# EasyEDA schematic SCH_orbital_shaker_motherboard_v2_2022-09-11.json
TITLE: Sheet_1; REV: 1.0; Date: 2022-09-11; Sheet: 1/1; Drawn By: danielgigliotti99.dg; Company: Your Company
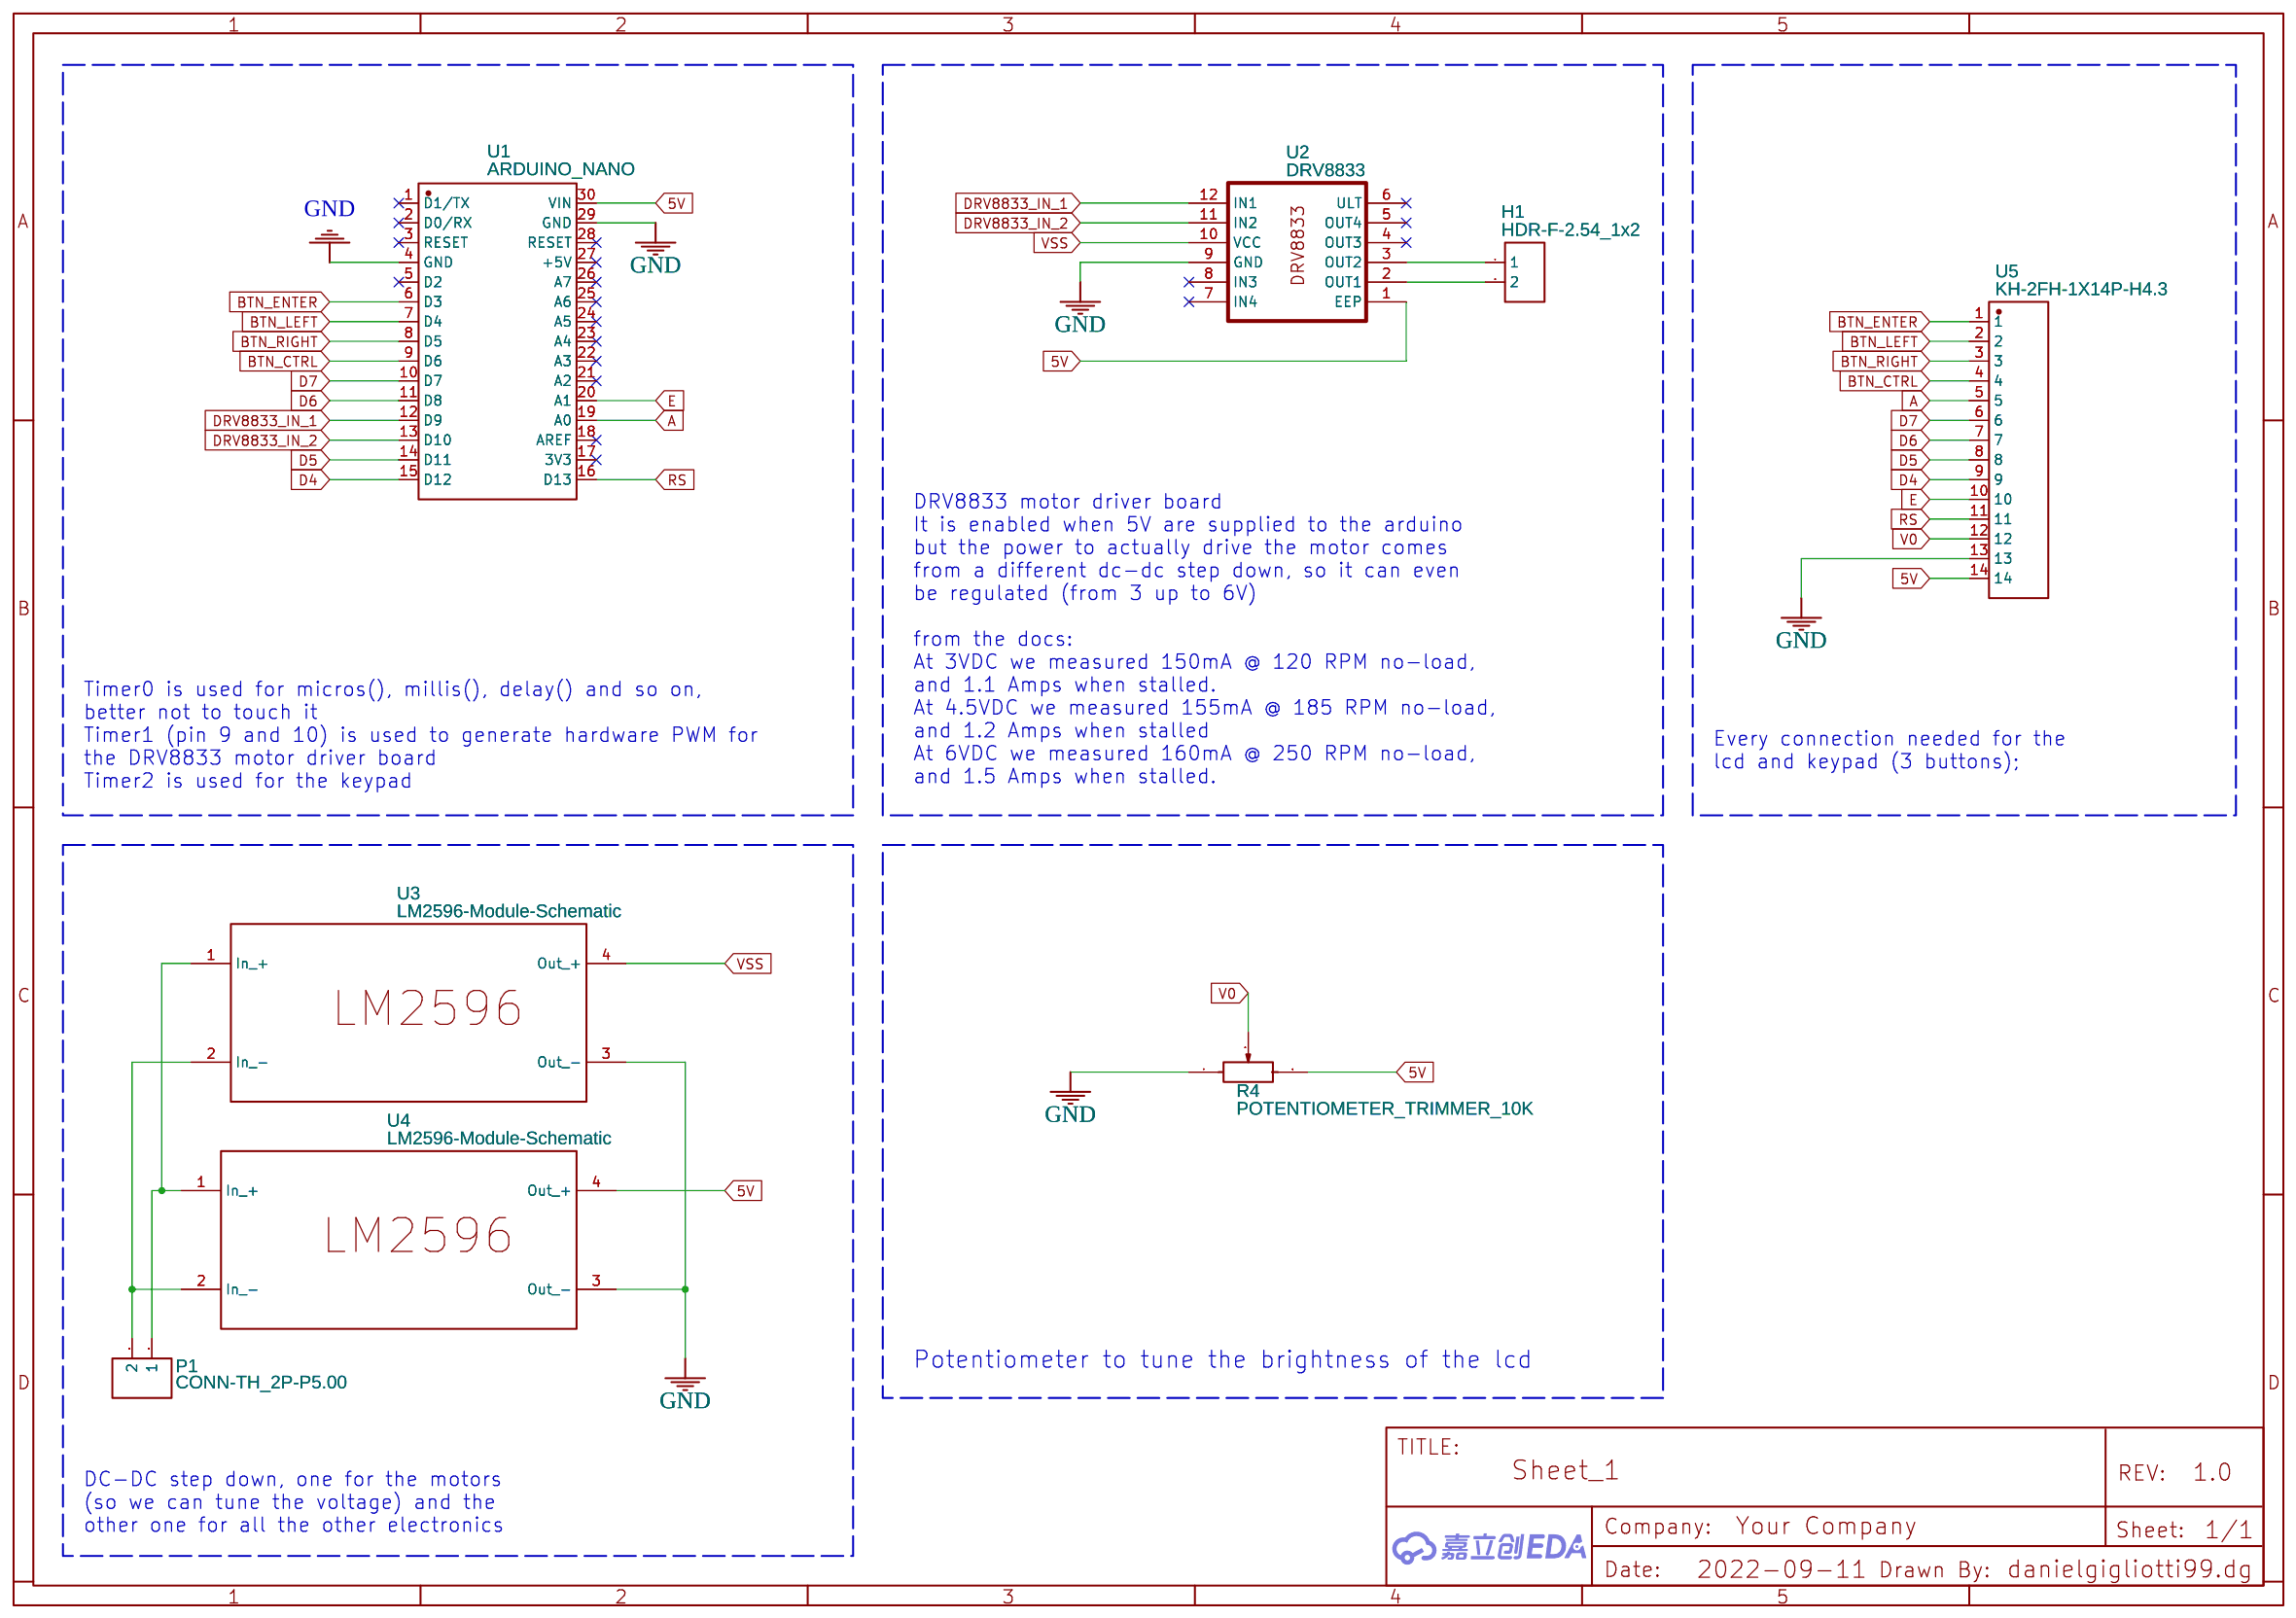
[diagram p0: schematic sheet]

## Parts
H1  HDR-F-2.54_1x2  [HDR-F-2.54_1X2]
P1  CONN-TH_2P-P5.00  [CONN-TH_2P-P5.00]
R4  POTENTIOMETER_TRIMMER_10K  [POTENTIOMETER_TRIMMER_10K]
U1  ARDUINO_NANO  [COMM-TH_ARDUINO_NANO]
U2  DRV8833  [DRV8833 (NO ORIGINAL)]
U3  LM2596-Module-Schematic  [LM2596-MODULE-SLS]
U4  LM2596-Module-Schematic  [LM2596-MODULE-SLS]
U5  KH-2FH-1X14P-H4.3  [CONN-TH_14P-P2.00_KINGHELM_KH-2FH-1X14P-H4.3]

## Library data of the parts
H1 = HDR-F-2.54_1x2: Supplier Part: C49661; Supplier: LCSC; Contributor: LCEDA_Lib
P1 = CONN-TH_2P-P5.00: Supplier: LCSC; Contributor: LCEDA_Lib
R4 = POTENTIOMETER_TRIMMER_10K: Contributor: Quentin_F; license: https://www.gnu.org/licenses/lgpl-2.1.html
U1 = ARDUINO_NANO: Supplier: LCSC; Supplier Part: C9900017879; Manufacturer: null; JLCPCB Part Class: Extended Part; Contributor: lcsc
U2 = DRV8833 (NO ORIGINAL): Contributor: PiterSantaCruz
U3 U4 = LM2596-Module-Schematic: Contributor: mark5094387dg0f9834lsd787
U5 = KH-2FH-1X14P-H4.3: Supplier: LCSC; Supplier Part: C2938436; Manufacturer: kinghelm(金航标); Contributor: LCSC

## Nets
5V: R4.3 U1.30(VIN) U2.1(EEP) U4.4(Out +) U5.14
GND: R4.1 U1.4(GND) U1.29(GND) U2.9(GND) U3.3(Out -) U4.3(Out -) U5.13
V0: R4.2 U5.12
VSS: U2.10(VCC) U3.4(Out +)
A: U1.19(A0) U5.5
BTN_CTRL: U1.9(D6) U5.4
BTN_ENTER: U1.6(D3) U5.1
BTN_LEFT: U1.7(D4) U5.2
BTN_RIGHT: U1.8(D5) U5.3
D4: U1.15(D12) U5.9
D5: U1.14(D11) U5.8
D6: U1.11(D8) U5.7
D7: U1.10(D7) U5.6
DRV8833_IN_1: U1.12(D9) U2.12(IN1)
DRV8833_IN_2: U1.13(D10) U2.11(IN2)
E: U1.20(A1) U5.10
RS: U1.16(D13) U5.11
Net-(H1-1): H1.1 U2.3(OUT2)
Net-(H1-2): H1.2 U2.2(OUT1)
Net-(P1-1): P1.1 U3.1(In +) U4.1(In +)
Net-(P1-2): P1.2 U3.2(In -) U4.2(In -)

Not connected (* = marked no-connect by the designer): U1 1(D1/TX)* 2(D0/RX)* 3(RESET)* 5(D2)* 17(3V3)* 18(AREF)* 21(A2)* 22(A3)* 23(A4)* 24(A5)* 25(A6)* 26(A7)* 27(+5V)* 28(RESET)*; U2 4(OUT3)* 5(OUT4)* 6(ULT)* 7(IN4)* 8(IN3)*

## Notes on the sheet
- DRV8833 motor driver board
  It is enabled when 5V are supplied to the arduino
  but the power to actually drive the motor comes
  from a different dc-dc step down, so it can even
  be regulated (from 3 up to 6V)
  from the docs:
  At 3VDC we measured 150mA @ 120 RPM no-load,
  and 1.1 Amps when stalled.
  At 4.5VDC we measured 155mA @ 185 RPM no-load,
  and 1.2 Amps when stalled
  At 6VDC we measured 160mA @ 250 RPM no-load,
  and 1.5 Amps when stalled.
- Timer0 is used for micros(), millis(), delay() and so on,
  better not to touch it
  Timer1 (pin 9 and 10) is used to generate hardware PWM for
  the DRV8833 motor driver board
  Timer2 is used for the keypad
- Every connection needed for the
  lcd and keypad (3 buttons);
- Potentiometer to tune the brightness of the lcd
- DC-DC step down, one for the motors
  (so we can tune the voltage) and the
  other one for all the other electronics
